# Altium project Arduino_mini_pro.PrjPcb
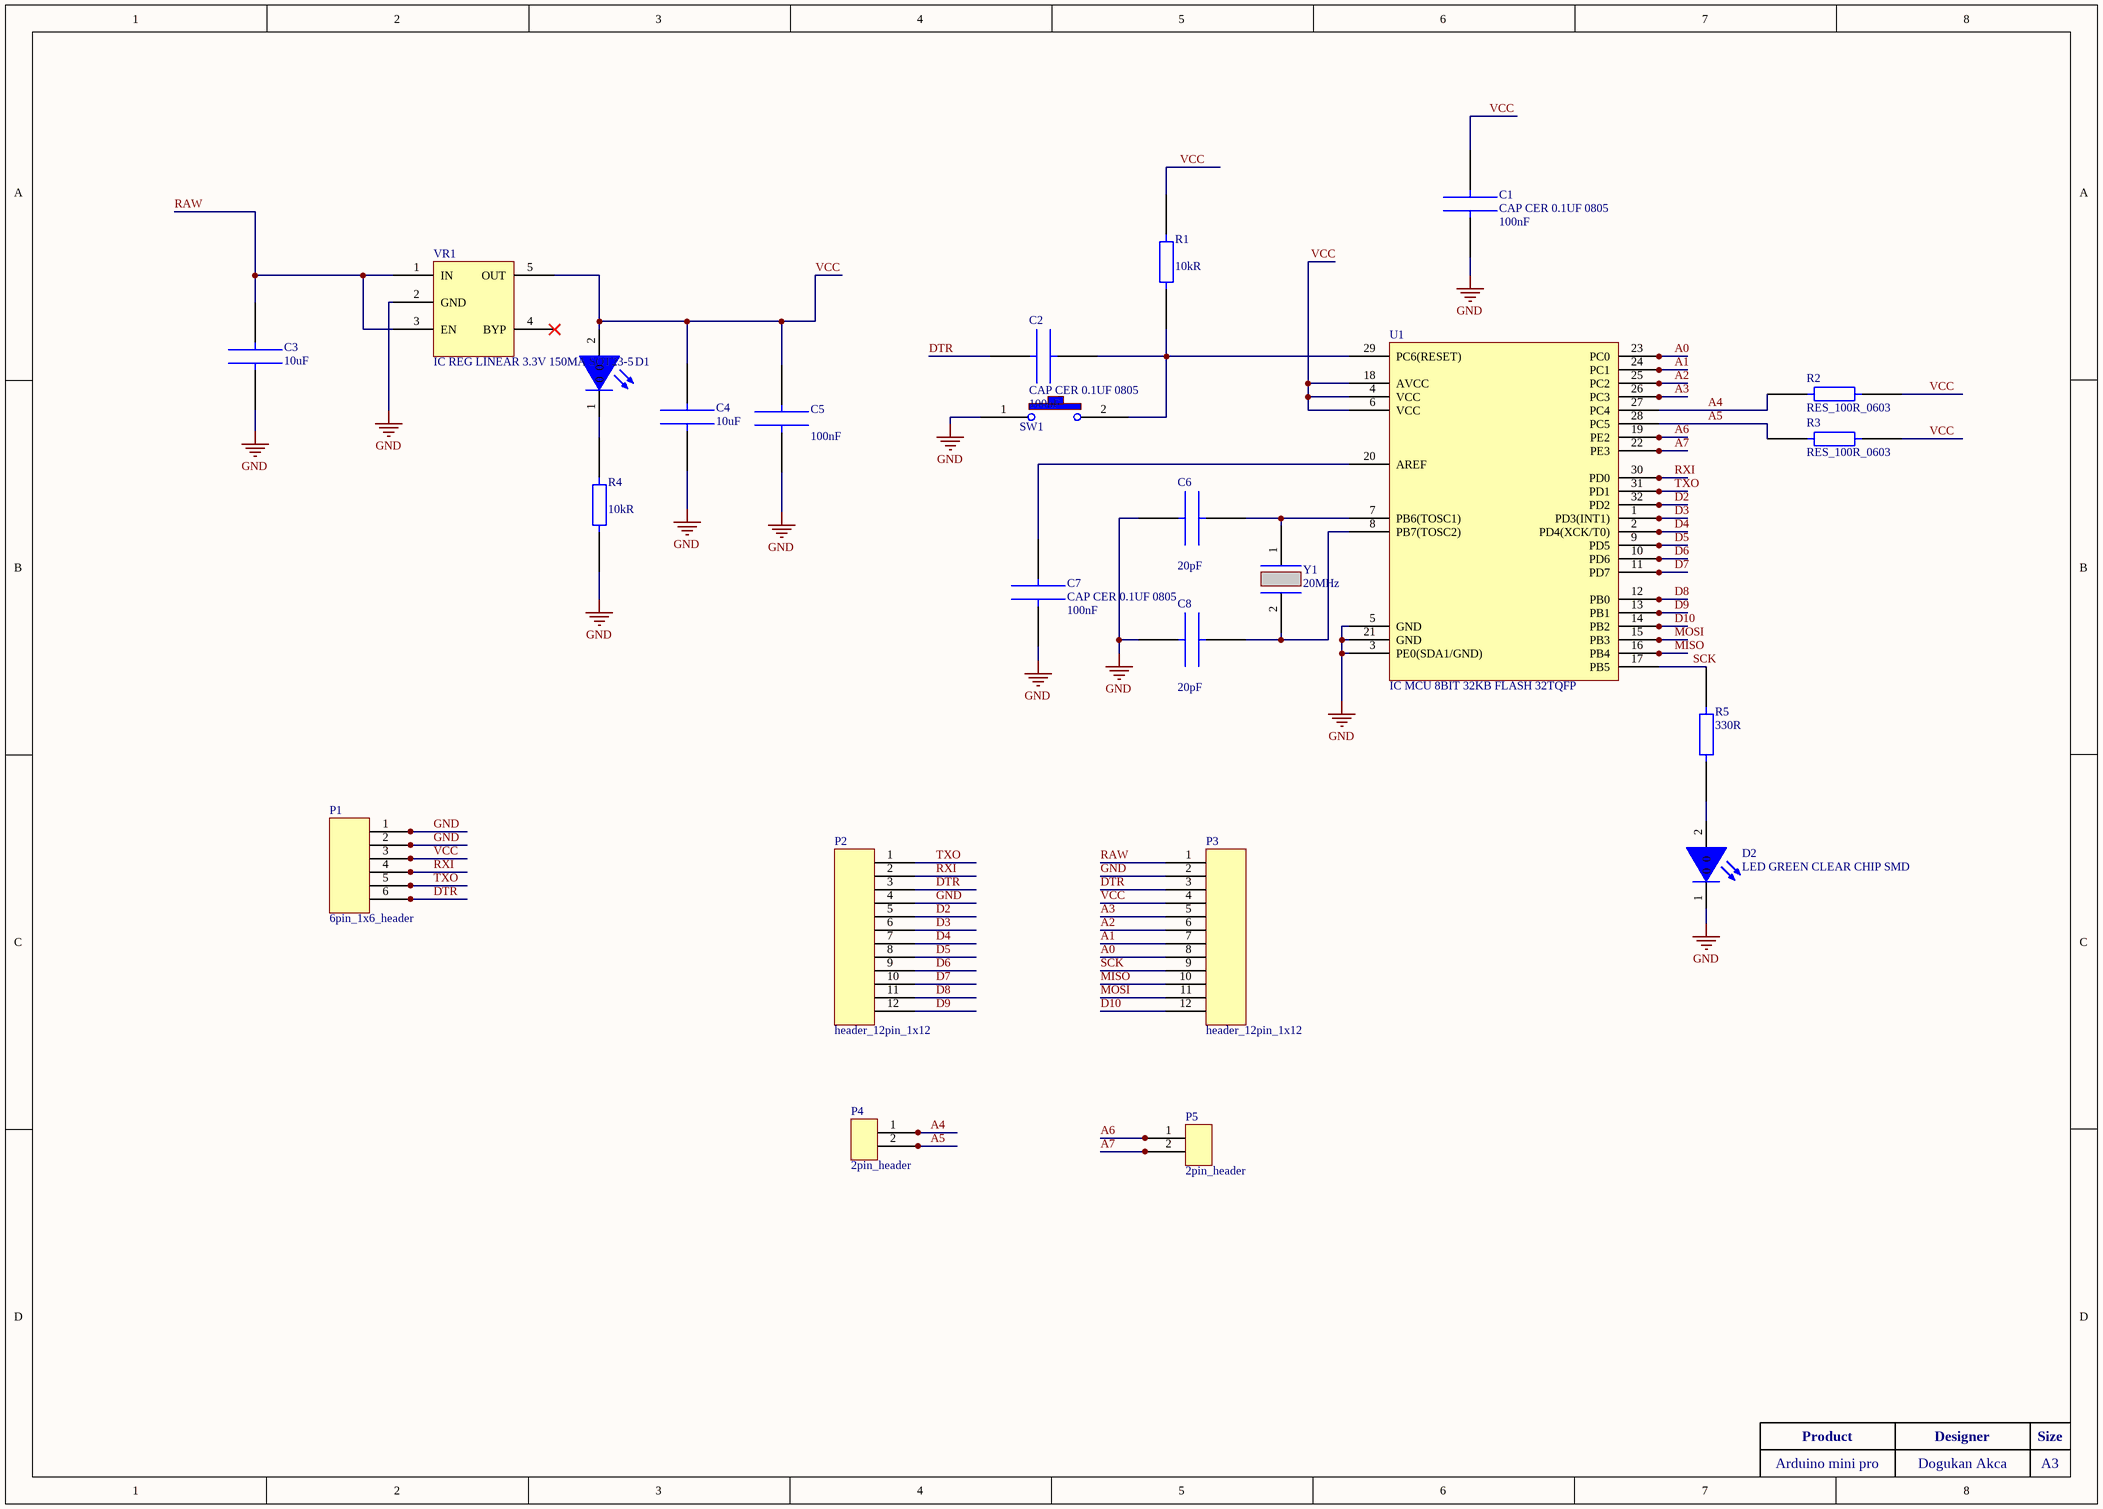
[diagram p0: arduino_schDoc.SchDoc]
1 sheet, 24 parts. Net scope: global (net labels, ports and power ports of the same name join across sheets).
Board file: arduino_pcbDoc.PcbDoc

## Sheet arduino_schDoc.SchDoc
size A3

### Parts
C1  CAP CER 0.1UF 0805  Capacitance: 100nF  [CAP_0805]
C2  CAP CER 0.1UF 0805  Capacitance: 100nF  [CAP_0805]
C3  Farad: 10uF  [0603_CAP]  (hidden comment: *CAP CER 10UF 4V X5R 0603)
C4  Farad: 10uF  [0603_CAP]  (hidden comment: *CAP CER 10UF 4V X5R 0603)
C5  Capacitance: 100nF  [CAP_0805]  (hidden comment: CAP CER 0.1UF 0805)
C6  Capacitance: 20pF  [0603_CAP]  (hidden comment: CAP CER 20PF 50V C0G/NP0 0603)
C7  CAP CER 0.1UF 0805  Capacitance: 100nF  [CAP_0805]
C8  Capacitance: 20pF  [0603_CAP]  (hidden comment: CAP CER 20PF 50V C0G/NP0 0603)
D1  LED RED DIFFUSED 0805 SMD  [0805_RED_LED]  (value not drawn)
D2  LED GREEN CLEAR CHIP SMD  [0805_LED_GREEN]
P1  6pin_1x6_header  [6_pin_header_1x6]
P2  header_12pin_1x12  [12_pin_header_1x12]
P3  header_12pin_1x12  [12_pin_header_1x12]
P4  2pin_header  [2pin_header_1x2]
P5  2pin_header  [2pin_header_1x2]
R1  Resistance: 10kR  [0603_RES]  (hidden comment: RES 10K OHM 0.5% 1/10W 0603)
R2  RES_100R_0603  [0603_RES]
R3  RES_100R_0603  [0603_RES]
R4  Resistance: 10kR  [0603_RES]  (hidden comment: RES 10K OHM 0.5% 1/10W 0603)
R5  330R  [0603_RES]
SW1  push button switch  [push_button]  (value not drawn)
U1  IC MCU 8BIT 32KB FLASH 32TQFP  [32-TQFP]
VR1  IC REG LINEAR 3.3V 150MA SOT23-5  [SOT23-5]
Y1  Frequency: 20MHz  [2-SMD_CRYSTAL 32.7680KHZ]  (hidden comment: CRYSTAL 20.0000MHZ 20PF SMD)

### Nets
GND: C1.1 C3.1 C4.1 C5.1 C6.1 C7.1 C8.1 D2.1(0) P1.1 P1.2 P2.4 P3.2 R4.1 SW1.1 U1.3(PE0(SDA1/GND)) U1.5(GND) U1.21(GND) VR1.2(GND)
A0: P3.8 U1.23(PC0)
A1: P3.7 U1.24(PC1)
A2: P3.6 U1.25(PC2)
A3: P3.5 U1.26(PC3)
A4: P4.1 R2.1 U1.27(PC4)
A5: P4.2 R3.1 U1.28(PC5)
A6: P5.1 U1.19(PE2)
A7: P5.2 U1.22(PE3)
D2: P2.5 U1.32(PD2)
D3: P2.6 U1.1(PD3(INT1))
D4: P2.7 U1.2(PD4(XCK/T0))
D5: P2.8 U1.9(PD5)
D6: P2.9 U1.10(PD6)
D7: P2.10 U1.11(PD7)
D8: P2.11 U1.12(PB0)
D9: P2.12 U1.13(PB1)
D10: P3.12 U1.14(PB2)
DTR: C2.1 P1.6 P2.3 P3.3
MISO: P3.10 U1.16(PB4)
MOSI: P3.11 U1.15(PB3)
RAW: C3.2 P3.1 VR1.1(IN) VR1.3(EN)
RXI: P1.4 P2.2 U1.30(PD0)
SCK: P3.9 R5.2 U1.17(PB5)
TXO: P1.5 P2.1 U1.31(PD1)
VCC: C1.2 C4.2 C5.2 D1.2(0) P1.3 P3.4 R1.2 R2.2 R3.2 U1.4(VCC) U1.6(VCC) U1.18(AVCC) VR1.5(OUT)
NetC2_2: C2.2 R1.1 SW1.2 U1.29(PC6(RESET))
NetC6_2: C6.2 U1.7(PB6(TOSC1)) Y1.1
NetC7_2: C7.2 U1.20(AREF)
NetC8_2: C8.2 U1.8(PB7(TOSC2)) Y1.2
NetD1_1: D1.1(0) R4.2
NetD2_2: D2.2(0) R5.1

Not connected (* = marked no-connect by the designer): VR1 4(BYP)*

### Notes on the sheet
- Product
- Arduino mini pro
- Dogukan Akca
- Designer
- Size
- A3

### Library data of the parts
C1 C2 C5 C7 = CAP CER 0.1UF 0805: CAP CER 0.1UF 50V X7R 0805; Manufacturer: Samsung; Manufacturer Part Number: CL21B104KBCNNNC; Designer: Dogukan; Material: Ceramic; Tolerance: 10%; Supplier 1: Digi-Key; RoHS: Yes; Category: Ceramic Capacitors; Stock 1: 1475056; Pricing 1: 1=0,1, 10=0,044, 50=0,024, 100=0,0196, 500=0,01404, 1000=0,01103 (USD); Mount: Surface Mount; Case/Package: 0805; Case Code (Metric): 2012; Case Code (Imperial): 0805; Min Operating Temperature: -55°C; Max Operating Temperature: 125°C; Dielectric: X7R; Packaging: Tape and Reel; Voltage Rating: 50V; Voltage: 50V; Voltage Rating (DC): 50V; Series: CL; Construction: Flat; Length: 2mm; Width: 0.049inch; Height: 0.85mm; Depth: 1.25mm; Thickness: 0.037inch; Radiation Hardening: No; Lead Free: Lead Free; RoHS Compliant: Yes; ComponentLink1URL: https://datasheet.ciiva.com/25710/cl21b104kbcnnnc-25710182.pdf?src-supplier=Digi-Key; ComponentLink1Description: https://datasheet.ciiva.com/25710/cl21b104kbcnnnc-25710182.pdf?src-supplier=Digi-Key; ComponentLink2URL: https://datasheet.ciiva.com/29199/454152-da-01-en-vs-kondensator-0805-29199814.pdf?src-supplier=Conrad; ComponentLink2Description: https://datasheet.ciiva.com/29199/454152-da-01-en-vs-kondensator-0805-29199814.pdf?src-supplier=Conrad; Supplier Part Number 1: 1276-1003-1-ND
C3 C4 = CAP CER 10UF 4V X5R 0603: 0603 10 uF 4 V ±20% Tolerance X5R Multilayer Ceramic Capacitor; Manufacturer: Yageo; Manufacturer Part Number: CC0603MRX5R4BB106; Designer: Dogukan; Supplier 1: Digi-Key; RoHS: Yes; Category: Ceramic Capacitors; Stock 1: 69941; Pricing 1: 1=0,19, 10=0,132, 50=0,0794, 100=0,067, 500=0,04588, 1000=0,04058 (USD); ComponentLink1URL: https://www.yageo.com/upload/media/product/productsearch/datasheet/mlcc/UPY-GPHC_X5R_4V-to-50V_26.pdf?src-supplier=Digi-Key; ComponentLink1Description: https://www.yageo.com/upload/media/product/productsearch/datasheet/mlcc/UPY-GPHC_X5R_4V-to-50V_26.pdf?src-supplier=Digi-Key; ComponentLink2URL: http://www.yageo.com/documents/recent/UPY-GPHC_X5R_4V-to-50V_25.pdf?src-supplier=Digi-Key; ComponentLink2Description: http://www.yageo.com/documents/recent/UPY-GPHC_X5R_4V-to-50V_25.pdf?src-supplier=Digi-Key; ComponentLink3URL: http://www.yageo.com/exep/pages/download/literatures/ProductSelectionGuide%202014_Final_2.pdf?src-supplier=Digi-Key; ComponentLink3Description: http://www.yageo.com/exep/pages/download/literatures/ProductSelectionGuide%202014_Final_2.pdf?src-supplier=Digi-Key; ComponentLink4URL: https://datasheet.octopart.com/CC0603MRX5R4BB106-Yageo-datasheet-137875056.pdf?src-supplier=Future+Electronics; ComponentLink4Description: https://datasheet.octopart.com/CC0603MRX5R4BB106-Yageo-datasheet-137875056.pdf?src-supplier=Future+Electronics; Supplier Part Number 1: 311-1812-1-ND
C6 C8 = CAP CER 20PF 50V C0G/NP0 0603: Manufacturer: Samsung; Manufacturer Part Number: CL10C200JB8NNNC; Designer: Dogukan; Tolerance: 5%; Dielectric: C0G; Temperature Coefficient: 300ppm/°C; Supplier 1: Digi-Key; RoHS: Yes; Category: Ceramic Capacitors; Stock 1: 464918; Pricing 1: 1=0,1, 10=0,044, 50=0,0238, 100=0,0194, 500=0,01386, 1000=0,01089 (USD); Mount: Surface Mount; Case/Package: 0603; Case Code (Metric): 1608; Case Code (Imperial): 0603; Min Operating Temperature: -55°C; Max Operating Temperature: 125°C; Package Quantity: 1; Packaging: Tape and Reel; Voltage Rating: 50V; Voltage: 50V; Series: CL; Construction: Flat; Length: 1.6mm; Width: 0.031inch; Height: 0.8mm; Thickness: 0.035inch; Depth: 0.8mm; Radiation Hardening: No; RoHS Compliant: Yes; ComponentLink1URL: https://datasheet.ciiva.com/26877/getdatasheetpartid-640634-26877974.pdf?src-supplier=Verical; ComponentLink1Description: https://datasheet.ciiva.com/26877/getdatasheetpartid-640634-26877974.pdf?src-supplier=Verical; ComponentLink2URL: https://datasheet.ciiva.com/26310/mlcc-catalogdownload2013-eng-26310315.pdf?src-supplier=Distrelec; ComponentLink2Description: https://datasheet.ciiva.com/26310/mlcc-catalogdownload2013-eng-26310315.pdf?src-supplier=Distrelec; Supplier Part Number 1: 1276-1187-1-ND
D1 = LED RED DIFFUSED 0805 SMD: Red 645nm LED Indication - Discrete 1.8V 0805 (2012 Metric); Designer: Dogukan
D2 = LED GREEN CLEAR CHIP SMD: Green 569nm LED Indication - Discrete 2.1V 0805 (2012 Metric); Manufacturer: Vishay Lite-On; Manufacturer Part Number: LTST-C171GKT; Designer: Dogukan; Lens Color: Colorless; Viewing Angle: 130°; Lens Style: Flat,Diffused,Colorless,Rectangular,Clear; Luminous Intensity: 12mcd; Forward Current: 30mA; Power Rating: 100mW; Test Current: 10mA; Number of Elements: 1; Wavelength: 585nm; Reverse Voltage: 5V; Lens Size: 1.25mm; Supplier 1: Digi-Key; RoHS: Yes; Category: LEDs; Stock 1: 213944; Pricing 1: 1=0,26, 10=0,143, 100=0,0663, 500=0,0612, 1000=0,04794 (USD); Mount: Surface Mount; Case/Package: 0805; Number of Pins: 2; Color: Green; Case Code (Metric): 2012; Case Code (Imperial): 0805; Min Operating Temperature: -55°C; Max Operating Temperature: 85°C; Package Quantity: 3000; Packaging: Tape and Reel; Forward Voltage: 2.1V; Illumination Color: Green; Dominant Wavelength: 569nm; Lens Transparency: Clear; Power Dissipation: 100mW; Number of LEDs: 1; Series: -; Length: 2mm; Width: 1.25mm; Height: 0.9mm; Depth: 1.25mm; Radiation Hardening: No; Lead Free: Lead Free; RoHS Compliant: Yes; ComponentLink1URL: https://datasheet.ciiva.com/11773/0900766b80dc0296-11773991.pdf?src-supplier=Rs; ComponentLink1Description: https://datasheet.ciiva.com/11773/0900766b80dc0296-11773991.pdf?src-supplier=Rs; ComponentLink2URL: https://datasheet.ciiva.com/2110/ltst-c171gkt-2110000.pdf?src-supplier=Digi-Key; ComponentLink2Description: https://datasheet.ciiva.com/2110/ltst-c171gkt-2110000.pdf?src-supplier=Digi-Key; ComponentLink3URL: https://datasheet.ciiva.com/12400/lite-on-ltst-c171gkt-190133-12400647.pdf?src-supplier=Mouser; ComponentLink3Description: https://datasheet.ciiva.com/12400/lite-on-ltst-c171gkt-190133-12400647.pdf?src-supplier=Mouser; ComponentLink4URL: https://datasheet.ciiva.com/2110/ltst-c171gkt-2110001.pdf?src-supplier=Digi-Key; ComponentLink4Description: https://datasheet.ciiva.com/2110/ltst-c171gkt-2110001.pdf?src-supplier=Digi-Key; ComponentLink5URL: https://datasheet.ciiva.com/2110/ltst-c171gkt-2110002.pdf?src-supplier=Digi-Key; ComponentLink5Description: https://datasheet.ciiva.com/2110/ltst-c171gkt-2110002.pdf?src-supplier=Digi-Key; ComponentLink6URL: https://datasheet.ciiva.com/16396/ltst-c171gkt-16396549.pdf?src-supplier=Future+Electronics; ComponentLink6Description: https://datasheet.ciiva.com/16396/ltst-c171gkt-16396549.pdf?src-supplier=Future+Electronics; Supplier Part Number 1: 160-1423-1-ND
P1 = 6pin_1x6_header: Designer: Dogukan
P2 P3 = header_12pin_1x12: Designer: Dogukan
P4 P5 = 2pin_header: Designer: Dogukan
R1 R4 = RES 10K OHM 0.5% 1/10W 0603: Res Thin Film 0603 10K Ohm 0.5% 1/10W ±25ppm/°C Molded SMD Paper T/R; Manufacturer: Yageo; Manufacturer Part Number: RT0603DRD0710KL; Designer: Dogukan; Power Rating: 100mW; Voltage Rating (DC): 50V; Supplier 1: Digi-Key; RoHS: Yes; Category: Chip SMD Resistors; Stock 1: 1584873; Pricing 1: 1=0,18, 10=0,151, 100=0,0592, 500=0,0358, 1000=0,02478, 2500=0,02271 (USD); Case/Package: 0603; Case Code (Imperial): 0603; Case Code (Metric): 1608; Size Code: 0603; Min Operating Temperature: -55°C; Max Operating Temperature: 155°C; Tolerance: 0.5%; Packaging: Cut Tape; Temperature Coefficient: 25ppm/°C; Series: RT; Max Power Dissipation: 100mW; Number of Terminations: 2; Width: 800um; Lead Free: Lead Free; RoHS Compliant: Yes; ComponentLink1URL: http://www.yageo.com/documents/recent/PYu-RT_1-to-0.01_RoHS_L_9.pdf?src-supplier=Digi-Key; ComponentLink1Description: http://www.yageo.com/documents/recent/PYu-RT_1-to-0.01_RoHS_L_9.pdf?src-supplier=Digi-Key; ComponentLink2URL: http://www.yageo.com/documents/recent/PYu-RT_1-to-0.05_RoHS_L_(4).pdf?src-supplier=Future+Electronics; ComponentLink2Description: http://www.yageo.com/documents/recent/PYu-RT_1-to-0.05_RoHS_L_(4).pdf?src-supplier=Future+Electronics; Supplier Part Number 1: 311-10KDCT-ND
R2 R3 = RES_100R_0603: Res Thick Film 0603 100 Ohm 1% 1/10W ±100ppm/°C Molded SMD Paper T/R; Manufacturer: Yageo; Manufacturer Part Number: RC0603FR-07100RL; Designer: Dogukan; Resistance: 100R; Max Power Dissipation: 100mW; Voltage Rating (DC): 50V; Supplier 1: Digi-Key; RoHS: Yes; Category: Chip SMD Resistors; Stock 1: 7267655; Pricing 1: 1=0,1, 10=0,018, 50=0,0106, 100=0,0088, 500=0,00592, 1000=0,00505 (USD); Case/Package: 0603; Number of Pins: 2; Case Code (Imperial): 0603; Case Code (Metric): 1608; Size Code: 0603; Min Operating Temperature: -55°C; Max Operating Temperature: 155°C; Tolerance: 1%; Packaging: Tape and Reel; Temperature Coefficient: 100ppm/°C; Series: RC; Number of Terminations: 2; Features: Moisture Resistant; Power Rating: 100mW; Termination: SMD/SMT; Voltage Rating: 50V; Resistor Type: Thick Film; Construction: Rectangular; Technology: THICK FILM; Resistance Tolerance: 1%; Length: 1.6mm; Width: 0.8mm; Height: 0.45mm; Depth: 0.8mm; RoHS Compliant: Yes; Lead Free: Lead Free; Military Standard: Not; Reach SVHC Compliant: Unknown; ComponentLink1URL: https://datasheet.ciiva.com/7660/38590-7660788.pdf?src-supplier=Element14; ComponentLink1Description: https://datasheet.ciiva.com/7660/38590-7660788.pdf?src-supplier=Element14; ComponentLink2URL: https://datasheet.ciiva.com/11808/0900766b80f96399-11808280.pdf?src-supplier=Rs; ComponentLink2Description: https://datasheet.ciiva.com/11808/0900766b80f96399-11808280.pdf?src-supplier=Rs; ComponentLink3URL: https://datasheet.ciiva.com/22747/443971-22747518.pdf?src-supplier=Element14; ComponentLink3Description: https://datasheet.ciiva.com/22747/443971-22747518.pdf?src-supplier=Element14; ComponentLink4URL: https://datasheet.ciiva.com/46440/1868787-46440890.pdf?src-supplier=Element14; ComponentLink4Description: https://datasheet.ciiva.com/46440/1868787-46440890.pdf?src-supplier=Element14; ComponentLink5URL: https://datasheet.ciiva.com/7746/1738695-7746238.pdf?src-supplier=Element14; ComponentLink5Description: https://datasheet.ciiva.com/7746/1738695-7746238.pdf?src-supplier=Element14; ComponentLink6URL: https://datasheet.ciiva.com/7746/1738695-7746237.pdf?src-supplier=Element14; ComponentLink6Description: https://datasheet.ciiva.com/7746/1738695-7746237.pdf?src-supplier=Element14; Supplier Part Number 1: 311-100HRDKR-ND
R5 = RES 330 OHM 1% 1/20W 0201: Res Thick Film 0201 330 Ohm 1% 1/20W ±200ppm/°C Molded SMD SMD Paper T/R; Manufacturer: Yageo; Manufacturer Part Number: RC0201FR-07330RL; Designer: Dogukan; Supplier 1: Digi-Key; RoHS: Yes; Category: Chip SMD Resistors; Stock 1: 553063; Pricing 1: 1=0,1, 10=0,026, 50=0,0162, 100=0,0136, 500=0,0094, 1000=0,00812, 5000=0,00598 (USD); ComponentLink1URL: https://datasheet.ciiva.com/8886/pyu-rc0201-51-rohs-l-8-8886150.pdf?src-supplier=Avnet; ComponentLink1Description: https://datasheet.ciiva.com/8886/pyu-rc0201-51-rohs-l-8-8886150.pdf?src-supplier=Avnet; ComponentLink2URL: https://datasheet.ciiva.com/22698/1563626-22698519.pdf?src-supplier=Element14; ComponentLink2Description: https://datasheet.ciiva.com/22698/1563626-22698519.pdf?src-supplier=Element14; ComponentLink3URL: https://datasheet.ciiva.com/7672/1563626-7672221.pdf?src-supplier=Element14; ComponentLink3Description: https://datasheet.ciiva.com/7672/1563626-7672221.pdf?src-supplier=Element14; ComponentLink4URL: https://datasheet.ciiva.com/26829/getdatasheetpartid-732949-26829863.pdf?src-supplier=Verical; ComponentLink4Description: https://datasheet.ciiva.com/26829/getdatasheetpartid-732949-26829863.pdf?src-supplier=Verical; Supplier Part Number 1: YAG2604CT-ND
SW1 = push_button
U1 = Atmega MCU 8BIT 32KB FLASH 32TQFP: AVR 32KBYTES Flash, 1KBYTES EEPROM, 2KBYTES Ram, W - 20MHZ, TQFP, Extended Temp, Green 5 V T&r; Manufacturer: Microchip; Manufacturer Part Number: ATMEGA328PB-ANR; Interface: I2C,SPI,UART,USART; Number of I/Os: 27; Oscillator Type: Internal; Peripherals: Brown-out Detect/Reset,POR,PWM,WDT; Designer: Dogukan; Supplier 1: Digi-Key; RoHS: No; Stock 1: 4740; Pricing 1: 1=1,85, 25=1,69, 100=1,52 (USD); Mount: Surface Mount; Case/Package: TQFP; Min Operating Temperature: -40°C; Max Operating Temperature: 105°C; Memory Type: FLASH; Memory Size: 32KB; Core Architecture: AVR; Series: AVR® ATmega, Functional Safety (FuSa); RoHS Compliant: No; ComponentLink1URL: http://www.atmel.com/images/atmel-42397-8-bit-avr-microcontroller-atmega328pb_summary.pdf?src-supplier=Avnet; ComponentLink1Description: http://www.atmel.com/images/atmel-42397-8-bit-avr-microcontroller-atmega328pb_summary.pdf?src-supplier=Avnet; ComponentLink2URL: http://www.microchip.com/mymicrochip/filehandler.aspx?ddocname=en589666&src-supplier=Digi-Key; ComponentLink2Description: http://www.microchip.com/mymicrochip/filehandler.aspx?ddocname=en589666&src-supplier=Digi-Key; ComponentLink3URL: https://datasheet.octopart.com/ATMEGA328PB-ANR-Microchip-datasheet-86810304.pdf?src-supplier=Farnell; ComponentLink3Description: https://datasheet.octopart.com/ATMEGA328PB-ANR-Microchip-datasheet-86810304.pdf?src-supplier=Farnell; ComponentLink4URL: http://www.farnell.com/datasheets/2337828.pdf?src-supplier=Element14; ComponentLink4Description: http://www.farnell.com/datasheets/2337828.pdf?src-supplier=Element14; ComponentLink5URL: https://datasheet.octopart.com/ATMEGA328PB-ANR-Microchip-datasheet-154741725.pdf?src-supplier=Electro+Sonic; ComponentLink5Description: https://datasheet.octopart.com/ATMEGA328PB-ANR-Microchip-datasheet-154741725.pdf?src-supplier=Electro+Sonic; Supplier Part Number 1: ATMEGA328PB-ANRCT-ND
VR1 = IC REG LINEAR 3.3V 150MA SOT23-5: Linear Voltage Regulator IC Positive Fixed 1 Output 3.3V 150mA SOT-23-5; Manufacturer: Microchip; Manufacturer Part Number: MIC5205-3.3YM5-TR; Dropout Voltage: 165mV; Number of Regulators: 1; Min Input Voltage: 2.5V; Max Input Voltage: 16V; Power Supply Rejection Ratio (PSRR): 75dB; Accuracy: 1%; Designer: Dogukan; Supplier 1: Digi-Key; RoHS: Yes; Pricing 1: 1=0,54, 25=0,45, 100=0,41 (USD); Mount: Surface Mount; Case/Package: SOT-23; Number of Pins: 5; Min Operating Temperature: -40°C; Max Operating Temperature: 125°C; Packaging: Tape and Reel; Output Voltage: 3.3V; Output Current: 150mA; Nominal Output Voltage: 3.3V; Number of Outputs: 1; Output Type: Fixed; Polarity: Positive; Series: -; Max Output Current: 150mA; Output Voltage Accuracy: 1%; Max Output Voltage: 3.3V; Max Supply Voltage: 16V; Min Supply Voltage: 2.5V; Termination: SMD/SMT; Length: 2.9mm; Width: 1.6mm; Height: 1.1mm; Radiation Hardening: No; Reach SVHC Compliant: No; Lead Free: Lead Free; RoHS Compliant: Yes; Category: Voltage Regulators - Linear
Y1 = CRYSTAL 20MHZ SMD: Crystal 20MHz ±30ppm (Tol) ±50ppm (Stability) 20pF FUND 30Ohm 2-Pin Mini-SMD T/R; Manufacturer: ECS International; Manufacturer Part Number: ECS-200-20-23A-EN-TR; ESR (Equivalent Series Resistance): 30R; Designer: Dogukan; Supplier 1: Digi-Key; RoHS: Yes; Category: Crystals; Stock 1: 8589; Pricing 1: 1=1,09, 10=0,964, 50=0,9012, 100=0,7963, 500=0,75442 (USD); Mount: Surface Mount; Case/Package: SMD/SMT; Min Operating Temperature: -10°C; Max Operating Temperature: 85°C; Package Quantity: 1000; Frequency Tolerance: 30ppm; Packaging: Tape and Reel; Frequency Stability: 50ppm; Termination: SMD/SMT; Series: ECX-64A; Load Capacitance: 20pF; Length: 6mm; Width: 3.5mm; Height: 1.1mm; Lead Free: Lead Free; ComponentLink1URL: https://datasheet.ciiva.com/859/ecx-64aen-ecx-64cen-859395.pdf?src-supplier=Digi-Key; ComponentLink1Description: https://datasheet.ciiva.com/859/ecx-64aen-ecx-64cen-859395.pdf?src-supplier=Digi-Key; ComponentLink2URL: https://datasheet.ciiva.com/859/ecx-64aen-ecx-64cen-859396.pdf?src-supplier=Digi-Key; ComponentLink2Description: https://datasheet.ciiva.com/859/ecx-64aen-ecx-64cen-859396.pdf?src-supplier=Digi-Key; ComponentLink3URL: https://datasheet.ciiva.com/859/ecx-64aen-ecx-64cen-859397.pdf?src-supplier=Digi-Key; ComponentLink3Description: https://datasheet.ciiva.com/859/ecx-64aen-ecx-64cen-859397.pdf?src-supplier=Digi-Key; Supplier Part Number 1: XC988CT-ND